# EAGLE board 8x8_stm32 (EAGLE 7.3.0)
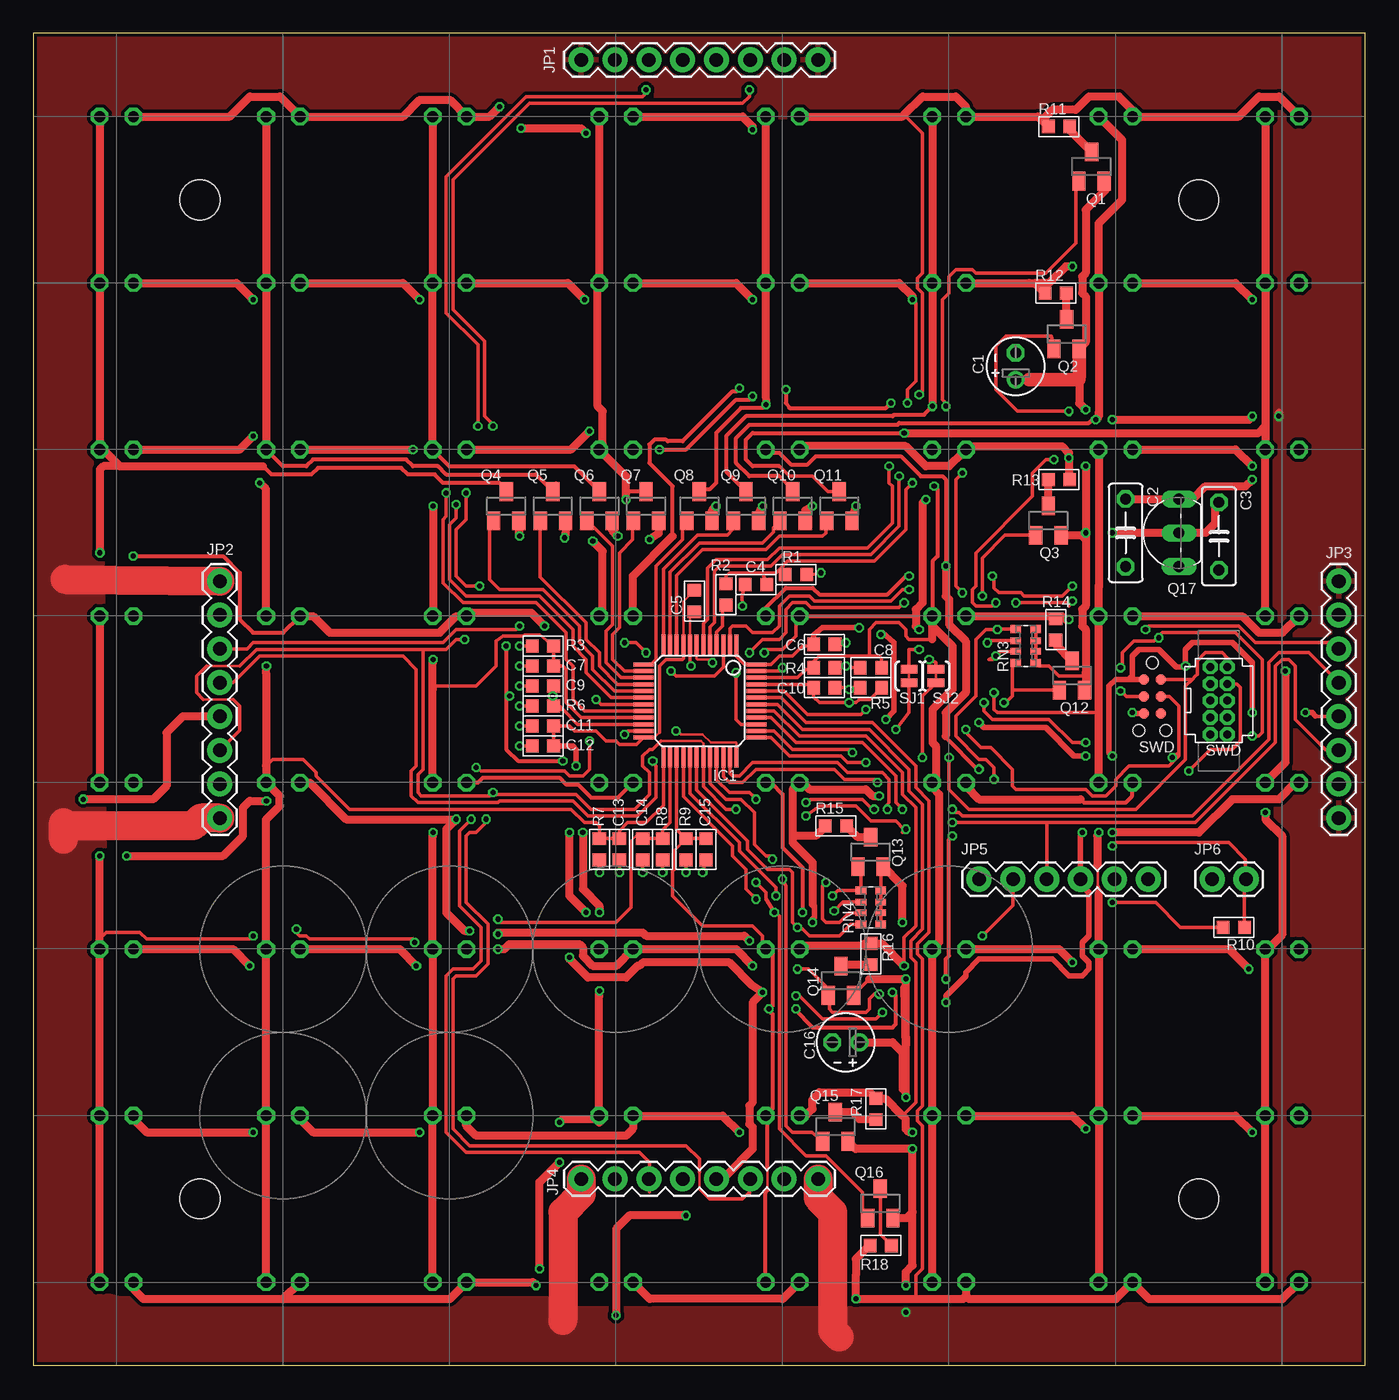
[diagram p1: board, top side]
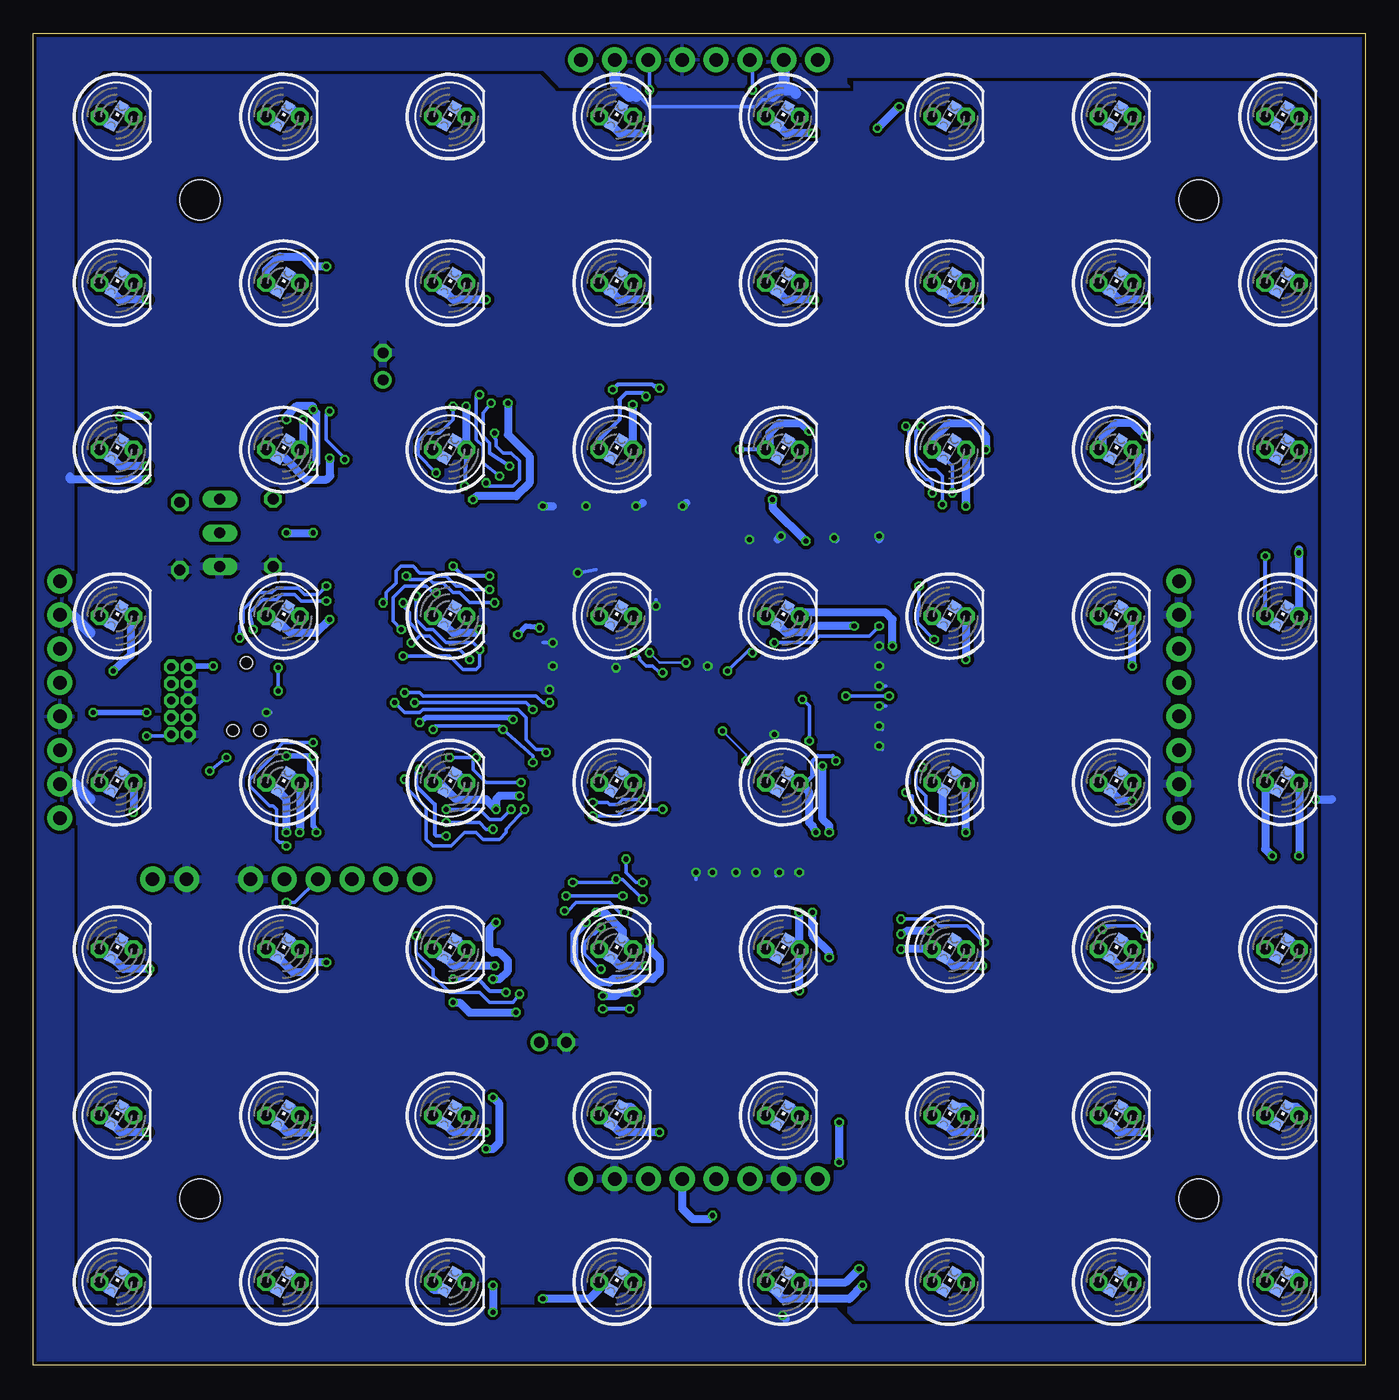
[diagram p2: board, bottom side, seen from below]

Size 100 x 100 mm. Coordinates in mm from the lower left corner, seen from the top.
Outline: 0,0 100,0 100,100 0,100 0,0
Copper layers (1*16): Top 0.035mm / dielectric 1.5mm / Bottom 0.035mm
Design rules "dirt_cheap_dirty_boards.v1": minimum track width 5mil, minimum drill 12mil, track to track 5mil, track to pad 5mil, pad to pad 5mil, via to via 5mil, smd to smd 0mil, copper to edge 10mil, drill to drill 10mil, minimum pad ring 10mil, minimum via ring 6mil, stop-mask expansion 2mil, vias tented up to drill 25mil, thermal gap 10mil
Holes 3 mm at 12.5,87.5 87.5,87.5 12.5,12.5 87.5,12.5

## Footprints (pad centres in the part's own frame; a part is rotated, then mirrored left to right if it is on the bottom)
E2-4 = drill 0.813 pad 1.27: + -1.016,0 | drill 0.813 pad 1.27 octagon: - 1.016,0
C050-025X075 = drill 0.813 octagon: 1 -2.54,0; 2 2.54,0
C0603-N = smd 0.95 x 1: 1 -0.8,0; 2 0.8,0
TQFP48 = smd 0.3 x 1.5: 1 -2.75,-4.25; 2 -2.25,-4.25; 3 -1.75,-4.25; 4 -1.25,-4.25; 5 -0.75,-4.25; 6 -0.25,-4.25; 7 0.25,-4.25; 8 0.75,-4.25; 9 1.25,-4.25; 10 1.75,-4.25; 11 2.25,-4.25; 12 2.75,-4.25; 25 2.75,4.25; 26 2.25,4.25; 27 1.75,4.25; 28 1.25,4.25; 29 0.75,4.25; 30 0.25,4.25; 31 -0.25,4.25; 32 -0.75,4.25; 33 -1.25,4.25; 34 -1.75,4.25; 35 -2.25,4.25; 36 -2.75,4.25 | smd 1.5 x 0.3: 13 4.25,-2.75; 14 4.25,-2.25; 15 4.25,-1.75; 16 4.25,-1.25; 17 4.25,-0.75; 18 4.25,-0.25; 19 4.25,0.25; 20 4.25,0.75; 21 4.25,1.25; 22 4.25,1.75; 23 4.25,2.25; 24 4.25,2.75; 37 -4.25,2.75; 38 -4.25,2.25; 39 -4.25,1.75; 40 -4.25,1.25; 41 -4.25,0.75; 42 -4.25,0.25; 43 -4.25,-0.25; 44 -4.25,-0.75; 45 -4.25,-1.25; 46 -4.25,-1.75; 47 -4.25,-2.25; 48 -4.25,-2.75
SWD_PTH_SHROUD = drill 0.6 octagon: 1 -2.54,-0.635; 2 -2.54,0.635; 3 -1.27,-0.635; 4 -1.27,0.635; 5 0,-0.635; 6 0,0.635; 7 1.27,-0.635; 8 1.27,0.635; 9 2.54,-0.635; 10 2.54,0.635
1X08_ROUND = drill 1.016 pad 1.88: 1 0,0; 2 2.54,0; 3 5.08,0; 4 7.62,0; 5 10.16,0; 6 12.7,0; 7 15.24,0; 8 17.78,0
1X06 = drill 1.016 pad 1.88: 1 0,0; 2 2.54,0; 3 5.08,0; 4 7.62,0; 5 10.16,0; 6 12.7,0
1X02 = drill 1.016 pad 1.88: 1 0,0; 2 2.54,0
TC2030-MCP-NL = smd 0.787 x 0.787: 1 1.27,-0.635; 2 1.27,0.635; 3 2.54,-0.635; 4 2.54,0.635; 5 3.81,-0.635; 6 3.81,0.635 | hole 0.889: 0,0; 5.08,-1.016; 5.08,1.016
LED5MM/SMD = drill 0.813 octagon: A -1.27,0; K 1.27,0 | smd 0.8 x 0.8 rotated 330: A1 -0.373,-0.609; K1 0.377,0.69
SOT23 = smd 1 x 1.4: 1 -0.95,-1.1; 2 0.95,-1.1; 3 0,1.1
TO92-INLINE = drill 0.813 long: GND -2.54,0; VIN 0,0; VOUT 2.54,0
R0603-N = smd 0.95 x 1: 1 -0.8,0; 2 0.8,0
EXB38V = smd 0.6 x 0.8: 1 -1.275,-0.75; 4 1.275,-0.75; 5 1.275,0.75; 8 -1.275,0.75 | smd 0.5 x 0.8: 2 -0.4,-0.75; 3 0.4,-0.75; 6 0.4,0.75; 7 -0.4,0.75
PAD-JUMPER-2-NC_BY_TRACE_YES_SILK = smd 0.635 x 1.27: 1 -0.508,0; 2 0.508,0

## Placement (x,y rotation side)
C1  [E2-4]  73.75,75 90 top
C2  [C050-025X075]  82,62.5 270 top
C3  [C050-025X075]  89,62.25 270 top
C4  100p  [C0603-N]  54.25,58.62 180 top
C5  [C0603-N]  49.62,57.38 270 top
C6  [C0603-N]  59.38,54.12 0 top
C7  100p  [C0603-N]  38.25,52.5 180 top
C8  100p  [C0603-N]  62.88,52.38 180 top
C9  100p  [C0603-N]  38.25,51 180 top
C10  100p  [C0603-N]  59.38,50.88 0 top
C11  [C0603-N]  38.25,48 180 top
C12  [C0603-N]  38.25,46.5 180 top
C13  100p  [C0603-N]  44,38.75 270 top
C14  100p  [C0603-N]  45.75,38.75 270 top
C15  100p  [C0603-N]  50.5,38.75 270 top
C16  [E2-4]  61,24.25 180 top
IC1  STM32F0  [TQFP48]  50.05,49.88 180 top
J1  SWD_SHROUD  [SWD_PTH_SHROUD]  89,49.9 270 top
JP1  [1X08_ROUND]  41.12,98 0 top
JP2  [1X08_ROUND]  14,58.88 270 top
JP3  [1X08_ROUND]  98,58.88 270 top
JP4  [1X08_ROUND]  41.12,14 0 top
JP5  [1X06]  71,36.5 0 top
JP6  [1X02]  88.5,36.5 0 top
JP7  TC2030-SWDNL  [TC2030-MCP-NL]  84,52.75 270 top
LED1  [LED5MM/SMD]  93.75,6.25 0 bottom
LED2  [LED5MM/SMD]  81.25,6.25 0 bottom
LED3  [LED5MM/SMD]  68.75,6.25 0 bottom
LED4  [LED5MM/SMD]  56.25,6.25 0 bottom
LED5  [LED5MM/SMD]  43.75,6.25 0 bottom
LED6  [LED5MM/SMD]  31.25,6.25 0 bottom
LED7  [LED5MM/SMD]  18.75,6.25 0 bottom
LED8  [LED5MM/SMD]  6.25,6.25 0 bottom
LED9  [LED5MM/SMD]  93.75,18.75 0 bottom
LED10  [LED5MM/SMD]  81.25,18.75 0 bottom
LED11  [LED5MM/SMD]  68.75,18.75 0 bottom
LED12  [LED5MM/SMD]  56.25,18.75 0 bottom
LED13  [LED5MM/SMD]  43.75,18.75 0 bottom
LED14  [LED5MM/SMD]  31.25,18.75 0 bottom
LED15  [LED5MM/SMD]  18.75,18.75 0 bottom
LED16  [LED5MM/SMD]  6.25,18.75 0 bottom
LED17  [LED5MM/SMD]  93.75,31.25 0 bottom
LED18  [LED5MM/SMD]  81.25,31.25 0 bottom
LED19  [LED5MM/SMD]  68.75,31.25 0 bottom
LED20  [LED5MM/SMD]  56.25,31.25 0 bottom
LED21  [LED5MM/SMD]  43.75,31.25 0 bottom
LED22  [LED5MM/SMD]  31.25,31.25 0 bottom
LED23  [LED5MM/SMD]  18.75,31.25 0 bottom
LED24  [LED5MM/SMD]  6.25,31.25 0 bottom
LED25  [LED5MM/SMD]  93.75,43.75 0 bottom
LED26  [LED5MM/SMD]  81.25,43.75 0 bottom
LED27  [LED5MM/SMD]  68.75,43.75 0 bottom
LED28  [LED5MM/SMD]  56.25,43.75 0 bottom
LED29  [LED5MM/SMD]  43.75,43.75 0 bottom
LED30  [LED5MM/SMD]  31.25,43.75 0 bottom
LED31  [LED5MM/SMD]  18.75,43.75 0 bottom
LED32  [LED5MM/SMD]  6.25,43.75 0 bottom
LED33  [LED5MM/SMD]  93.75,56.25 0 bottom
LED34  [LED5MM/SMD]  81.25,56.25 0 bottom
LED35  [LED5MM/SMD]  68.75,56.25 0 bottom
LED36  [LED5MM/SMD]  56.25,56.25 0 bottom
LED37  [LED5MM/SMD]  43.75,56.25 0 bottom
LED38  [LED5MM/SMD]  31.25,56.25 0 bottom
LED39  [LED5MM/SMD]  18.75,56.25 0 bottom
LED40  [LED5MM/SMD]  6.25,56.25 0 bottom
LED41  [LED5MM/SMD]  93.75,68.75 0 bottom
LED42  [LED5MM/SMD]  81.25,68.75 0 bottom
LED43  [LED5MM/SMD]  68.75,68.75 0 bottom
LED44  [LED5MM/SMD]  56.25,68.75 0 bottom
LED45  [LED5MM/SMD]  43.75,68.75 0 bottom
LED46  [LED5MM/SMD]  31.25,68.75 0 bottom
LED47  [LED5MM/SMD]  18.75,68.75 0 bottom
LED48  [LED5MM/SMD]  6.25,68.75 0 bottom
LED49  [LED5MM/SMD]  93.75,81.25 0 bottom
LED50  [LED5MM/SMD]  81.25,81.25 0 bottom
LED51  [LED5MM/SMD]  68.75,81.25 0 bottom
LED52  [LED5MM/SMD]  56.25,81.25 0 bottom
LED53  [LED5MM/SMD]  43.75,81.25 0 bottom
LED54  [LED5MM/SMD]  31.25,81.25 0 bottom
LED55  [LED5MM/SMD]  18.75,81.25 0 bottom
LED56  [LED5MM/SMD]  6.25,81.25 0 bottom
LED57  [LED5MM/SMD]  93.75,93.75 0 bottom
LED58  [LED5MM/SMD]  81.25,93.75 0 bottom
LED59  [LED5MM/SMD]  68.75,93.75 0 bottom
LED60  [LED5MM/SMD]  56.25,93.75 0 bottom
LED61  [LED5MM/SMD]  43.75,93.75 0 bottom
LED62  [LED5MM/SMD]  31.25,93.75 0 bottom
LED63  [LED5MM/SMD]  18.75,93.75 0 bottom
LED64  [LED5MM/SMD]  6.25,93.75 0 bottom
Q1  BSS84  [SOT23]  79.44,90 0 top
Q2  BSS84  [SOT23]  77.57,77.42 0 top
Q3  BSS84  [SOT23]  76.2,63.42 0 top
Q4  BSS123  [SOT23]  35.5,64.5 0 top
Q5  BSS123  [SOT23]  39,64.5 0 top
Q6  BSS123  [SOT23]  42.5,64.5 0 top
Q7  BSS123  [SOT23]  46,64.5 0 top
Q8  BSS123  [SOT23]  50,64.5 0 top
Q9  BSS123  [SOT23]  53.5,64.5 0 top
Q10  BSS123  [SOT23]  57,64.5 0 top
Q11  BSS123  [SOT23]  60.5,64.5 0 top
Q12  BSS84  [SOT23]  77.98,51.79 0 top
Q13  BSS84  [SOT23]  62.85,38.54 0 top
Q14  BSS84  [SOT23]  60.62,28.88 0 top
Q15  BSS84  [SOT23]  60.21,17.92 0 top
Q16  BSS84  [SOT23]  63.58,12.17 0 top
Q17  MCP1700  [TO92-INLINE]  86,62.5 90 top
R1  DNP  [R0603-N]  57.25,59.38 180 top
R2  2k2  [R0603-N]  52,57.88 270 top
R3  DNP  [R0603-N]  38.25,54 0 top
R4  DNP  [R0603-N]  59.38,52.38 180 top
R5  DNP  [R0603-N]  62.88,50.88 0 top
R6  DNP  [R0603-N]  38.25,49.5 0 top
R7  DNP  [R0603-N]  42.5,38.75 90 top
R8  DNP  [R0603-N]  47.25,38.75 90 top
R9  DNP  [R0603-N]  49,38.75 90 top
R10  [R0603-N]  90.12,32.88 180 top
R11  [R0603-N]  77,93 0 top
R12  [R0603-N]  76.75,80.5 0 top
R13  [R0603-N]  77,66.5 180 top
R14  [R0603-N]  76.75,55.25 270 top
R15  [R0603-N]  60.25,40.5 0 top
R16  [R0603-N]  62.88,30.88 270 top
R17  [R0603-N]  63.25,19.25 270 top
R18  [R0603-N]  63.62,9 0 top
RN3  [EXB38V]  74.5,54 90 top
RN4  [EXB38V]  62.88,34.38 90 top
SJ1  [PAD-JUMPER-2-NC_BY_TRACE_YES_SILK]  65.75,51.75 90 top
SJ2  [PAD-JUMPER-2-NC_BY_TRACE_YES_SILK]  67.75,51.75 90 top

## Tracks (layer width: path | path; a pad name or v marks a point on that pad's centre or on a via)
+3V3  (via drill 0.38)
  Top 0.2: IC1.9 48.8,57.35 C5.1 | 46.63,47.13 47,47.5
  Top 0.254: JP3.5 96.28,48.72 96.25,48.75 | C12.1 C11.1 40.25,48 40.62,47.62 42.25,47.62 43,46.88 43.75,46.88 44,46.62 45.3,46.62 IC1.24 46.63,47.13 | v63.75,26.5 63.25,26 59.25,26 57.5,27.75 v57.25,27.75 | R10.2 86.12,32.88 84.25,34.75 v81,34.75 | IC1.1 52.8,53.2 53.37,52.63 IC1.48 55.38,52.63 56,53.25 57,53.25 57.75,54 58.45,54 C6.1 | 47,47.5 47,52.5 47.5,53 48.75,53 48.8,53.05 IC1.9
  Top 0.406: v79,45.75 78.12,45.75 76,47.88 71.38,47.88 v71,48.25 | v63.62,54.88 63.75,55 64.62,54.25 64.62,49.12 v64,48.5 | v40.75,45 40.75,46.25 40.5,46.5 C12.1 | C6.1 58.58,54.83 59.25,55.38 v62,55.38 | v68.5,27.25 68.5,27.75 70,29.25 70,29.5 71,30.5 76.5,30.5 77.75,29.25 78.75,29.25 79.25,29.75 79.25,30.25 78.75,30.75 78.75,31.75 79.25,32.25 79.25,35.5 78.62,36.13 JP5.4 78.62,39.87 v78.75,40 | v95.5,49 96,49 96.25,48.75 | v81,45.75 80.75,46 80.75,51 81.25,51.5 82.25,51.5 | 82.25,51.5 83.34,51.5 JP7.1 | 82.25,51.5 82.5,51.75 82.5,53.25 83,53.75 84.5,53.75 85.81,52.44 86.44,52.44 v86.5,52.5 86.5,53.75 87,54.25 90,54.25 91.5,52.75 v91.5,49
  Top 0.61: C2.1 Q17.VOUT 87.04,65.04 88,66 91,66 v91.5,66.5 | v41.5,34 40.25,35.25 v40.25,40 | v40.25,30.62 40.25,30.5 41.62,29.12 44.5,29.12 45.38,30 45.5,30 45.75,30.25 52.25,30.25 54,28.5 v54.75,28 54,27.25 54,19.75 53.75,19.5 53.75,18.12 54,17.88 54,16.25 52,14.25 51.5,14.25 51.25,14 | JP2.5 11.21,48.72 10,47.5 10,43.5 9,42.5 v3.75,42.5 | v49,11.25 44.75,11.25 43.75,10.25 v43.75,3.75
  Bottom 0.254: v81,34.75 80.37,34.75 JP5.4
  Bottom 0.406: v81,45.75 79.25,45.75 | v71,48.25 70.5,48.62 64,48.62 v64,48.5 | v78.75,40 78.75,40.25 79,40.5 79,43 78.75,43.25 78.75,44.25 79.25,44.75 79.25,45.75 | 79.25,45.75 v79,45.75 | v62,55.38 63,55.5 v63.62,54.88 | v91.5,49 v95.5,49 | v86.5,52.5 88.31,52.5 J1.1
  Bottom 0.61: v68.5,27.25 68,27.25 67.25,26.5 v63.75,26.5 | v57.25,27.75 56.25,27.75 56,28 v54.75,28 | v41.5,34 41.5,32.25 40.25,31 v40.25,30.62 | v40.25,40 40.25,40.5 40.75,41 v40.75,45 | v3.75,42.5 2.5,42.5 | JP4.5 51.28,11.79 50.5,11 49.25,11 v49,11.25 | v43.75,3.75 43.5,3.5 | 97.25,66.75 97.25,66.5 v91.5,66.5
  pour Bottom (isolate 0.254): 39.25,100 0,100.25 0,-0.25 100,-0.25 100,4.25 39.75,4.25 38.5,3 5.5,3 3.25,5.25 3.25,95 5,96.75 39.25,96.75
  pour Bottom (isolate 0.254): 68.75,0 100.25,0 100.25,100.5 39.25,100.5 39,100.75 39,96.25 38.75,96 60.5,96 61.75,97.25 94.75,97.25 97,95 97,4.5 95,2.5 69,2.25 68.5,2.25
+5V  (via drill 0.38)
  Top 0.254: RN4.1 RN4.2 RN4.3 RN4.4 63.62,37.27 Q13.2 | 75.22,55.27 RN3.4 RN3.3 RN3.2 RN3.1 75.47,52.5 76.25,52.5 77,51.75 78.75,51.75 79,52 | Q14.2 61.9,28.15 62.75,29 | 2.38,59 2.38,58.62 2.25,58.5 2.25,59.5
  Top 0.61: v79,67.5 v79,62.5 79,62 | 79,62 79,57 78.75,56.75 78.75,55.5 79,55.25 79,52 79,50.76 Q12.2 | v65.5,20.12 65.5,21 | 65.5,21 65.5,23.8 65.4,28.4 65.5,24 v65.5,29 62.75,29 | v65.25,33.25 65.25,36 65.06,36.19 Q13.2 | 78.5,73.98 78.52,74 78.52,72.23 v79,71.75 | C16.+ 64.5,24.25 65.25,23.5 65.25,20.75 65.5,21 | 65.53,6.03 v65.5,6 65.5,7 66,7.5 66,11.5 | C3.1 88.75,64.54 88.75,63.25 88,62.5 Q17.VIN v81,62.5 | Q16.2 65.57,11.07 66,11.5 | 66,11.5 v66,16.25 61.73,16.25 Q15.2 | Q1.2 80.5,88.79 80.5,88.25 79,86.75 79,82 78.75,81.75 78.75,80.5 79,80.25 79,76.8 Q2.2 | Q3.2 78.68,62.32 79,62 | v81,71 91.25,71 v91.5,71.25 | v93.5,71.25 93.5,71.5 | C1.+ 74.73,73.98 74.75,74
  Top 1.016: 74.75,74 78.25,74 | 78.25,74 78.49,74 78.5,73.98 | Q2.2 78.52,74.27 78.25,74
  Top 2.184: 2.25,39.5 2.25,40.5 | 2.25,40.5 2.25,40.75 | JP4.1 41.12,12.88 39.75,11.5 39.75,3.38 | JP4.8 58.91,12.6 60,11.5 60,2.62 60.5,2.12 | JP2.8 12.6,41.09 12,40.5 2.25,40.5 | 2.38,59 JP2.1
  Bottom 0.61: v79,67.5 78.75,67.75 78.75,71.5 v79,71.75 79,72 80.25,72 81,71.25 v81,71 | v66,16.25 65.5,16.25 65,16.75 65,19.62 v65.5,20.12 | v65.5,29 65,29 64.38,29.62 64.38,30.38 65,31 65.5,31 65.75,31.25 65.75,32.75 v65.25,33.25 | v65.5,6 v65.5,4 | v81,62.5 v79,62.5 | v91.5,71.25 v93.5,71.25
  pour Top (isolate 0.254): 68.75,0 100.25,0 100.25,100.5 39.25,100.5 39,100.75 39,96.25 38.75,93.75 60.5,93.75 93.75,94.25 92.5,93.25 92.5,4.75 90,4.75 69.25,4.25 68.5,2.25
  pour Top (isolate 0.254): 60,100 0,100.25 0,-0.25 100,-0.25 100,4.25 39.75,4.25 39.5,5 6.5,5 5.5,5.25 5,93.5 5.5,94 60,93.75
CFET1
  Top 0.254: IC1.10 48.3,59.3 50.25,61.25 55,61.25 56,62.25 59.25,62.25 59.5,62.5 59.5,63.35 Q11.1
CFET2
  Top 0.254: IC1.11 47.8,59.55 50,61.75 54.75,61.75 55.55,62.55 55.55,62.9 Q10.1
CFET3
  Top 0.254: IC1.12 47.3,59.8 49.85,62.35 52.1,62.35 52.5,62.75 52.5,63.35 Q9.1
CFET4
  Top 0.254: Q8.1 48.75,63.1 48.75,62 46.75,60 46.75,53 46.38,52.63 IC1.13
CFET5
  Top 0.254: IC1.14 44.37,52.13 43.5,53 43.5,54.88 44,55.38 44,61 45,62 45,63.35 Q7.1
CFET6
  Top 0.254: IC1.15 44.12,51.63 43,52.75 43,55.12 43.5,55.62 43.5,61.5 41.6,63.4 Q6.1
CFET7
  Top 0.254: Q5.1 38.05,59.2 41.5,55.75 41.5,54.5 42.5,53.5 42.5,52.5 43.87,51.13 IC1.16
CFET8
  Top 0.254: IC1.17 43.62,50.63 42,52.25 42,53.25 41,54.25 41,55.5 38.25,58.25 35,58.25 34.25,59 34.25,63.1 Q4.1
COL1  (via drill 0.38)
  Top 0.2: 44.88,37.12 44.88,39.38 45.25,39.75 45.7,39.75 C14.1
  Top 0.254: IC1.26 47.8,40.75 47.25,40.2 R8.2 C14.1 | v34.88,33.5 35.12,33.25 43.75,33.25 44.88,34.38 44.88,37.12 | v28.62,31.75 28.5,32 20.75,32 20.5,32.25 20,32.25 19.75,32.5 v19.75,32.75 | v16.5,32.25 16.25,32 8.5,32 8,32.5 5.48,32.5 4.98,32 | 35.65,65.75 Q4.3
  Top 0.305: 17.25,67.5 17.88,66.88 20.88,66.88 21.38,67.38 27.62,67.38 28.12,66.88 30.12,66.88 30.75,66.25 35,66.25 35.5,65.75 35.65,65.75
  Top 0.61: LED8.K LED16.K LED24.K 4.98,32 4.98,38.23 | v4.98,38.25 4.98,38.23 | 4.98,38.23 5,38.25 | LED64.K LED56.K LED48.K 5.25,68.75 6.5,67.5 | 6.5,67.5 17.25,67.5 | 6.5,67.5 5.25,67.5 5,67.25 v5,61 | 5,56.27 LED40.K LED32.K
  Bottom 0.254: v34.88,33.5 32.5,33.5 32,33 29.88,33 v28.62,31.75 | v19.75,32.75 19.5,33 17.25,33 v16.5,32.25
  Bottom 0.61: LED24.K1 5.67,31.94 LED24.K | LED16.K1 5.17,19.44 4.98,19.25 LED16.K | LED8.K1 5.17,6.94 4.98,6.75 LED8.K | LED64.K1 5.67,94.44 LED64.K | LED56.K1 5.67,81.94 LED56.K | LED48.K1 5.67,69.44 LED48.K | LED40.K1 5.67,56.94 5,56.27 | 5,56.27 LED40.K | LED32.K1 5.67,44.44 LED32.K v4.98,38.25 | 5,61.25 v5,61 5,56.27
COL2  (via drill 0.38)
  Top 0.254: 17.48,45 17.98,45.5 20.25,45.5 21.25,44.5 21.25,44.25 23.75,41.75 40.38,41.75 41.38,40.75 42.25,40.75 42.5,40.5 R7.2 C13.1 44,40.12 44.62,40.75 46,40.75 47.3,42.05 IC1.25 | Q5.3 39,66 39.25,66.25
  Top 0.305: LED47.K 18.73,67.5 20.5,67.5 21,68 28,68 28.5,67.5 30.38,67.5 31,66.88 37.73,66.88 Q5.3
  Top 0.61: LED7.K LED15.K LED23.K 17.48,40.98 18.5,42 18.5,42.73 LED31.K 17.48,45 17.48,51.98 v17.5,52.5 | LED63.K LED55.K LED47.K 17.48,68.52 | LED39.K 17.48,65.77 v17,66.25
  Bottom 0.61: LED7.K1 18.17,6.94 LED7.K | LED15.K1 18.17,19.44 LED15.K | LED23.K1 18.17,31.94 LED23.K | LED31.K1 18.17,44.44 LED31.K | LED63.K1 18.17,94.44 LED63.K | LED55.K1 18.17,81.94 LED55.K | LED47.K1 17.68,68.75 LED47.K 17,68.27 v17,66.25 | v17.5,52.5 17.5,56.23 LED39.K 18.17,56.94 LED39.K1
COL3  (via drill 0.38)
  Top 0.2: 39,54 38,54.88 36.88,54.88 36.75,54.75
  Top 0.254: IC1.21 41.12,48.63 40,49.75 40,52.25 39.75,52.5 C7.1 R3.2 39,54 | 36.75,54.75 35.25,54.75 34.75,54.38 34.75,52.5 33.25,51 30.23,51 29.98,50.75 | 42.1,66 Q6.3
  Top 0.305: LED46.K 31.23,67.5 40.6,67.5 Q6.3
  Top 0.61: LED6.K LED14.K LED22.K 29.98,39.73 v30,40 | LED62.K LED54.K LED46.K | LED30.K 29.98,50.75 29.98,52.73 v30,53 | v30,64.5 30,56.27 LED38.K
  Bottom 0.61: LED6.K1 30.67,6.94 LED6.K | LED14.K1 30.17,19.44 29.98,19.25 LED14.K | LED22.K1 30.67,31.94 LED22.K | LED62.K1 30.67,94.44 LED62.K | LED54.K1 30.67,81.94 LED54.K | 29.98,66 LED46.K 30.67,69.44 LED46.K1 | 29.98,66 29.98,64.52 v30,64.5 30,65.98 29.98,66 | v30,53 30,56.23 LED38.K 30.67,56.94 LED38.K1 | LED30.K1 30.67,44.44 LED30.K 30,43.73 v30,40
COL4  (via drill 0.38)
  Top 0.254: IC1.22 40.87,48.13 39.75,49.25 | 39.75,49.25 39.5,49.5 R6.2 39.05,50.2 v39,50.25 39.05,50.3 C9.1 | 39.75,49.25 39,49.25 | v35.75,50.25 35.5,50.25
  Top 0.305: v35.5,54 35.5,50.25 35.5,46.25 36.38,45.38 v39.75,45.38 | Q7.3 44.6,65.6 44.5,65.5
  Top 0.61: 42.5,18.23 LED13.K | LED61.K LED53.K 42.38,81.14 42.38,72 42.75,71.62 42.75,69.12 42.48,68.86 LED45.K 44.5,66.73 44.5,65.5 v44.5,65 | 42.48,56.02 LED37.K 42.48,56.27 42.75,56.5 42.75,61.12 v42,61.88 | LED13.K 42.48,27.73 v42.5,28.12 | 42.5,34.25 v42.5,34 42.5,34.5 41.25,35.75 v41.25,40 | v38,7.25 38,13.75 v39.5,15.25 | v39.5,18.25 39.75,18.5 42.23,18.5 LED13.K
  Bottom 0.254: v39,50.25 v35.75,50.25
  Bottom 0.305: 42.25,43.75 42,43.75 41.5,44.25 41.5,45.38 41.12,45.75 40,45.75 v39.75,45.38
  Bottom 0.61: LED5.K1 43.17,6.94 LED5.K 39,6.25 v38,7.25 | LED13.K1 43.17,19.44 LED13.K | LED21.K1 43.17,31.94 LED21.K | LED53.K1 43.17,81.94 LED53.K | LED61.K 42.68,93.75 LED61.K1 | LED29.K 42.68,43.75 LED29.K1 | v41.25,40 41.5,40.5 41.75,40.75 41.75,43.02 LED29.K | LED45.K1 43.17,69.44 LED45.K | LED37.K1 42.68,56.25 LED37.K 42.23,56.5 36,56.5 35.5,56 v35.5,54 | LED29.K 42.25,43.75 | v42.5,28.12 42.5,31.23 LED21.K | LED21.K 42.48,34.02 v42.5,34 | v39.5,15.25 v39.5,18.25 | v44.5,65 44.5,64.38 v42,61.88
COL5  (via drill 0.38)
  Top 0.2: 55.12,13.17 55.12,14.8
  Top 0.23: 48.12,37.25 48.12,38.67 R9.2
  Top 0.254: LED20.K 54.75,31.48 54.75,32.25 54,33 50.25,33 48,35.25 48,37.12 48.12,37.25 | C15.1 R9.2 48.3,40.25 IC1.27 | 49.95,66.06 Q8.3
  Top 0.3: 65.5,59.25 v65.75,59.25
  Top 0.305: v55,72.12 54.75,71.88 53.12,71.88 51.25,70 51.25,66.25 50.75,65.75 50.15,65.75 Q8.3 | 65.5,59.25 64.12,57.88 59,57.88 58.5,58.38 56.5,58.38 54.98,56.85 LED36.K | 68.5,47.25 68.5,47.12 70.88,44.75 71,45 v71,44.75 | LED28.K 55.38,43.75 56.25,42.88 56.25,38.88 57.75,37.38 v57.75,34 | LED20.K 55.12,31.25 55.5,30.88 55.5,27.02 v55.23,26.75 55,26.75 55.5,26.38 55.5,19.27 LED12.K 55.12,18.61 55.12,14.8 | v57.25,26.75 57.12,26.75 58.5,25.38 64.5,25.38 64.75,25.62 64.75,27.75 v64.5,28 | v68.5,29 68.5,30.5 68.75,30.75 68.75,39.5 v69,39.75 | 54.98,68.52 55.98,68.52 56.88,67.62 58.12,67.62 58.75,68.25 65.12,68.25 66.62,66.75 68.25,66.75 68.5,66.5 v68.5,60 | LED4.K 54.98,12.98 55.12,13.17
  Top 0.61: LED60.K LED52.K 54.98,73.02 v55,72.12 | LED44.K 54.98,68.52 | v68.5,60 68.5,57.75 68.75,57.5 68.75,55.62 70,54.38 70,50.5 68.5,49 68.5,47.25
  Bottom 0.254: LED36.K1 55.67,56.94 | v69,39.75 69.75,39.75 69.88,39.88
  Bottom 0.3: v65.75,59.25 67.75,59.25 v68.5,60
  Bottom 0.305: 55.67,56.94 LED36.K | v71,44.75 71.25,44.5 71.25,43.5 69.88,42.12 69.88,39.88 | v55.23,26.75 v57.25,26.75 | v68.5,29 66.62,29 65.75,28.12 64.62,28.12 v64.5,28
  Bottom 0.61: LED4.K1 55.67,6.94 LED4.K | LED12.K1 55.17,19.44 54.98,19.25 LED12.K | LED20.K 55.67,31.94 LED20.K1 55.75,32.06 55.75,32.62 57.12,34 v57.75,34 | LED52.K 55.18,81.25 LED52.K1 | LED60.K 55.18,93.75 LED60.K1 | v55,72.12 55,68.77 LED44.K 55.67,69.44 LED44.K1 | LED28.K1 55.67,44.44 LED28.K
COL6  (via drill 0.38)
  Top 0.254: C8.1 63.67,53.08 63.5,53.25 62.75,53.25 | 62.75,53.25 59,53.25 58.58,52.83 R4.2 58.45,52.25 58,52.25 57.38,51.63 IC1.46 | 67.48,54.5 65.75,54.5 65.5,54.75 65.5,55.25 65,55.75 63.25,55.75 62.75,55.25 62.75,53.25
  Top 0.305: v67.5,72 66.88,71.38 64.62,71.38 64.5,71.25 53.5,71.25 52,69.75 52,67.1 Q9.3 | v67.62,66 67.88,65.75 67.88,60.75 67.5,60.38 67.5,56.27 LED35.K
  Top 0.61: LED3.K LED11.K LED19.K 68,31.77 68,42.88 67.48,43.4 LED27.K 67.75,44.02 67.75,46.5 67.5,46.75 67.5,49.25 69,50.75 69,54 67.48,55.52 | LED59.K LED51.K 67.48,72.02 v67.5,72 | LED35.K 67.48,55.52 | 67.48,54.5 67.48,55.52
  Bottom 0.254: LED35.K1 68.17,56.94 LED35.K
  Bottom 0.305: 67.5,68.73 v67.62,66
  Bottom 0.61: LED3.K1 68.17,6.94 LED3.K | LED11.K1 68.17,19.44 LED11.K | LED19.K1 68.17,31.94 LED19.K | LED51.K 67.68,81.25 LED51.K1 | LED59.K 67.68,93.75 LED59.K1 | v67.5,72 67.5,68.77 LED43.K | LED43.K1 68.17,69.44 LED43.K | LED27.K1 68.17,44.44 LED27.K | 67.5,68.73 LED43.K
COL7  (via drill 0.38)
  Top 0.2: 79.9,36.01 79.9,37.51
  Top 0.254: IC1.45 58.82,51.13 58.82,51.12 C10.1 58.58,50.17 59,49.75 v61.25,49.75 61.75,49.75 62,50 62.8,50 R5.2 | 79.98,49.25 79.73,49 72.38,49 72.12,49.25 v72.12,50.5 | 80,35.5 80,35.75 79.9,36.01 | 56,66.75 56.5,66.25 56.85,65.75 Q10.3
  Top 0.305: 79.98,71.5 79.23,70.75 65,70.75 64.88,70.62 53.75,70.62 52.75,69.62 52.75,67.75 53.75,66.75 56,66.75
  Top 0.61: LED58.K 81.75,91.98 81.75,87.5 79.98,85.73 LED50.K 79.98,71.5 79.98,71.23 v79.75,71 | LED42.K 79.98,58.52 | 79.98,58.52 80,58.5 | LED2.K LED10.K LED18.K 80,31.27 80,35.5 | LED26.K 79.98,49.25 LED34.K 79.98,58.52 | v80,40 79.88,39.75 79.88,37.53 79.9,37.51
  Bottom 0.254: LED34.K1 80.67,56.94 LED34.K | v61.25,49.75 61.75,49.75 62.25,50.25 70.75,50.25 71,50.5 v72.12,50.5
  Bottom 0.61: LED50.K1 80.67,81.94 LED50.K | v79.75,71 79.75,68.98 LED42.K 80.67,69.44 LED42.K1 | LED58.K1 80.67,94.44 LED58.K | LED26.K1 80.67,44.44 LED26.K 79.98,40.52 v80,40 | LED18.K1 80.67,31.94 LED18.K | LED2.K1 80.67,6.94 LED2.K | LED10.K1 80.67,19.44 LED10.K
COL8  (via drill 0.38)
  Top 0.254: C4.1 54.8,59.3 54.75,59.5 | 54.75,59.5 55.75,59.5 56,59.75 | 56,59.75 56.62,60.38 63.12,60.38 65.5,62.75 65.5,65.75 v66,66.25 | R2.1 52,59.25 52.25,59.5 54.75,59.5 | R1.2 56.38,59.38 56,59.75 | Q11.3 59.65,65.6 58.5,66.75 56.75,66.75 56,67.5
  Top 0.305: 56,67.5 54,67.5 53.5,68 53.5,69.5 54,70 v65.38,70
  Top 0.61: LED57.K LED49.K 92.48,70.5 | 92.48,70.5 LED41.K 92.5,68.73 92.5,56.27 LED33.K | v65.38,70 91.98,70 92.48,70.5 | LED1.K LED9.K LED17.K 92.76,31.53 92.97,31.53 93.75,32.32 93.75,39.75 92.5,41 v92.5,41.5 | v94,52.12 94,45.27 LED25.K
  Bottom 0.254: v66,66.25 66,66 64,66 63.5,66.5 63.5,67.88 64.12,68.5 64.75,68.5 65.25,69 65.25,69.5 65.5,69.75 v65.38,70
  Bottom 0.61: LED57.K1 93.17,94.44 LED57.K | LED49.K1 93.17,81.94 LED49.K | LED41.K1 93.17,69.44 LED41.K | LED17.K 92.68,31.25 LED17.K1 | LED9.K1 93.17,19.44 LED9.K | LED1.K1 93.17,6.94 LED1.K | LED33.K 92.68,56.25 | 92.68,56.25 LED33.K1 | 92.68,56.25 92.68,53.32 v94,52.12 | LED25.K1 93.17,44.44 LED25.K 92.48,41.52 v92.5,41.5
COMMS_DOWN  (via drill 0.38)
  Top 0.254: IC1.19 42.62,49.63 v42.25,50 | v33.25,44.88 33.62,44.62 39.88,44.62 40.25,44.25 41.25,44.25 41.75,44.75 v41.75,46.88 | JP4.3 46.25,13.04 46.25,15.25 45.5,16 32.5,16 31,17.5 31,29.25 31.5,29.75 33,29.75 33.62,30.38 33.62,32.88 32,34.5 32,40.12 v32.88,41
  Bottom 0.254: v42.25,50 41.75,49.5 v41.75,46.88 | v33.25,44.88 33.38,44.88 33.75,44.5 33.75,43.5 33,42.75 33,41.12 v32.88,41
COMMS_LEFT  (via drill 0.38)
  Top 0.254: v36.5,55.5 36.25,55.25 31.75,55.25 30.75,54.25 16.5,54.25 16.05,53.8 JP2.3 | v44.38,54.25 45.25,54.25 v46,53.5 | IC1.3 51.8,52.42 51.12,51.75 48.25,51.75 v47.88,52.12
  Bottom 0.254: v36.5,55.5 37.25,54.75 41,54.75 41.5,54.25 v44.38,54.25 44.5,54.25 | v46,53.5 46.25,53.75 v47.88,52.12
COMMS_RIGHT  (via drill 0.38)
  Top 0.254: JP3.3 97.75,53.75 97.25,54.25 91.75,54.25 90.5,55.5 83.75,55.5 v83.5,55.25 | 77.75,57 v78,57.38 77.88,57.25 v73.75,57.25 | v65.75,58.25 65.25,58.25 64.38,57.38 58.62,57.38 58.25,57.75 56.75,57.75 56,57 56,55.5 55.5,55 54,55 53.5,55.5 52.5,55.5 52.3,55.3 IC1.2
  Bottom 0.254: v73.75,57.25 73.5,57.5 73.5,58 72.75,58.75 72.75,59.62 72.38,60 71.5,60 71,59.5 70,59.5 69.75,59.25 69,59.25 68.25,58.5 67.75,58.5 67.5,58.25 v65.75,58.25 | v83.5,55.25 83.75,56.5 82.75,57.5 81.75,57.5 81.38,57.88 80.38,57.88 79.88,57.38 v78,57.38
COMMS_UP  (via drill 0.38)
  Top 0.254: IC1.18 43.37,50.13 41.5,52 41.5,53 40.5,54 40.5,55.25 38,57.75 32.5,57.75 31.25,59 31.25,63.12 31.75,63.62 v31.75,64.62 | v33.38,70.5 33.38,76.62 31,79 31,89.25 37,95.25 45.75,95.25 46,95.5 v46,95.75
  Bottom 0.254: v31.75,64.62 31.75,66.75 32.25,67.25 32.75,67.25 33.75,68.25 33.75,70.12 v33.38,70.5 | v46,95.75 46,97.8 JP1.3
G_UART  (via drill 0.38)
  Top 0.2: IC1.31 50.3,46.7 50.12,46.88 47.12,46.88 | 15.5,52.5 13,52.5 | 34.5,42.88 34.38,42.75 | 12.75,50 15,50 | 50,13.25 50,14.5
  Top 0.254: 76,40.75 87.25,40.75 93.25,46.75 93.25,52.5 93.75,53 94.25,53 94.75,52.5 94.75,48.5 97,46.25 97.67,46.25 JP3.6 | 76,40.75 v69,40.75 | 65.25,40 v65.5,40.25 65.38,40.25 64.75,40.88 62.88,40.88 61.75,42 59,42 v58,41.25 | IC1.31 50.3,43.45 52,41.75 v52.75,41.75 | v33.5,58.5 32.5,58.5 31.75,59.25 31.75,62.75 32.5,63.5 v32.5,65.5 | 29.25,53.75 31,53.75 31.75,54.5 v32.38,54.5 | 29.25,53.75 29.25,44.75 28.88,44.38 28.88,43 29.12,42.75 34.25,42.75 v34.5,43 | JP5.3 76.08,40.67 76,40.75 | 29.25,53.75 16.75,53.75 15.5,52.5 | 13,52.5 12.25,51.75 12.25,50.5 12.75,50 | 50,13.25 50.75,12.5 53.25,12.5 53.75,13 53.75,12.93 JP4.6 | 34.5,42.88 v34.5,43 | v34.5,70.5 34.5,70.62 33.88,71.25 33.88,76.88 31.5,79.25 31.5,89 37.25,94.75 53.25,94.75 53.75,95.25 v53.75,95.75 | 47.12,46.88 46.5,46.25 46.25,46.25 45.75,45.75 45.75,45 46.25,44.5 46.25,42.88 45.12,41.75 41.88,41.75 40.75,42.88 34.62,42.88 v34.5,43 | v34,41 34,40.75 33.25,40 32.75,40 32.5,39.75 32.5,34.75 34.12,33.12 34.12,30.12 33.25,29.25 31.75,29.25 31.5,29 31.5,17.75 32.75,16.5 49,16.5 50,15.5 50,14.5 | 15,50 15.5,49.5 15.5,47.67 JP2.6
  Bottom 0.254: v52.75,41.75 55.62,41.75 56.12,41.25 v58,41.25 | 32.38,54.62 v32.38,54.5 33.62,55.75 33.62,56.62 33.5,56.75 v33.5,58.5 | v34.5,70.5 34.5,70.38 34.25,70.12 34.25,67.75 33,66.5 32.75,66.5 32.5,66.25 v32.5,65.5 | v34,41 34,42.75 34.25,42.75 v34.5,43 | v65.5,40.25 66,40.25 66.5,40.75 v69,40.75 | v53.75,95.75 53.75,97.92 JP1.6
GND  (via drill 0.38)
  Top 0.2: IC1.8 49.3,56.25 C5.2
  Top 0.254: C12.2 v36.5,46.5 | C11.2 v36.5,48 | R6.1 v36.5,49.5 | C9.2 v36.5,51 | C7.2 v36.5,52.5 | R3.1 v36.5,54 | R7.1 v42.5,37 | C13.2 v44,37 | C6.2 60.88,54.12 v61,54.25 | R4.1 60.88,52.38 v61,52.5 61.12,52.38 C8.2 | C4.2 53.2,57.8 v53.25,57 | R1.1 59.3,59.45 v59.12,59.5 | C10.2 61.12,50.88 v61.25,50.75 61.38,50.88 R5.1 | C15.2 v50.25,37 | R9.1 v49,37 | R8.1 v47.25,37 | C14.2 v45.75,37 | IC1.8 49.3,52.95 v49.38,52.5 | IC1.23 44.63,47.63 v44.38,47.38 | IC1.47 56.01,52.13 v56.25,52.38
  Top 0.406: JP7.5 82.56,48.94 v82.5,49
  Top 0.61: Q4.2 36.45,62.55 v36.5,62.25 | Q5.2 39.95,62.45 v39.88,62.12 | Q6.2 43.45,62.67 v43.88,62.25 | Q7.2 46.95,62.45 v46.25,62 | Q8.2 50.95,64.2 v51.25,64.5 | Q11.2 61.45,63.2 v61.75,64.5 | Q10.2 57.95,64.2 v58.5,64.5 | Q9.2 54.45,63.95 v54.75,64.5
  Bottom 0.254: v49.38,52.5 49.5,52.25 | v36.5,46.5 36.25,46.25 | v36.5,48 36.25,47.75 | v36.5,49.5 36,49.5 | v36.5,51 36,51 | v36.5,52.5 36.25,52.5 | v36.5,54 36.25,54 | v42.5,37 42.5,36.75 | v44,37 44.25,36.75 | v61,54.25 61.75,54.25 | v61,52.5 61,52.25 | v53.25,57 53.25,57.5 | v59.12,59.5 57.75,59.75 | v61.25,50.75 61.25,51 | v50.25,37 50.25,36.5 | v47.25,37 47.25,36.75 | v45.75,37 45.75,36.75 | 54.75,95.25 54.5,95.25 53.75,94.5 45.75,94.5 45.25,95 44.75,95 44.12,95.62
  Bottom 0.406: v82.5,49 82.25,49
  Bottom 0.61: v36.5,62.25 36.5,62 | v39.88,62.12 39.75,62 | v43.88,62.25 44.12,62 | v51.25,64.5 51,64.75 | v54.75,64.5 54.25,64.75 | v61.75,64.5 61,64.5
  Bottom 0.813: JP1.7 56.37,96.36 55.5,95.5 | 55.5,95.5 55,95.5 54.75,95.25 | JP1.2 43.66,95.92 | 43.66,95.92 43.5,95.75 43,95.75 42.75,95.5 | 43.66,95.92 43.84,95.92 44.12,95.62 44.5,95.25 | 55.25,95.25 55.5,95.5 | JP3.7 96.89,43.63 95.75,42.5 | JP3.2 97,56.25 95.75,55
  pour Bottom (isolate 0.254, rank 2): 102.75,101 103.5,100.25 103.5,0.25 -1.25,-2.25 -6.75,100.5
N$9  (via drill 0.38)
  Top 0.254: IC1.44 56.37,50.63 58.12,48.88 62.12,48.88 v62.5,49.25 | v79,46.75 78,46.75 76.25,48.5 72,48.5 71.38,49.12 v71.38,49.75 | v81,39 81.25,39.25 89.75,39.25 91,38 91,36.54 JP6.2 90.92,36.38 R10.1
  Bottom 0.254: v62.5,49.25 63,49.75 v71.38,49.75 | v79,46.75 81.25,46.75 81.75,46.25 81.75,46 83.75,44 83.75,43.5 82.25,42 82,42 81.75,41.75 81.75,39.5 81.5,39.25 81.25,39.25 v81,39
N$11
  Top 0.254: IC1.4 51.3,55.05 51.75,55.5 51.75,56.83 R2.2
N$12
  Top 0.61: R11.2 77.8,92.74 Q1.3
N$13
  Top 0.61: Q2.3 77.57,80.48 R12.2
N$14
  Top 0.61: Q3.3 R13.2
N$15
  Top 0.61: R14.2 76.75,54.12 Q12.3
N$16
  Top 0.61: Q13.3 61.91,39.64 R15.2
N$17
  Top 0.61: R16.2 60.98,30.07 Q14.3
N$18
  Top 0.61: Q15.3 61.48,19.02 62,18.5 63.2,18.5 R17.2
N$19
  Top 0.254: Q16.3 63.58,9.85 R18.2
NRST  (via drill 0.38)
  Top 0.2: IC1.7 49.8,53.08 49.88,53 50.75,53 v51,52.75
  Top 0.254: v65.38,57.25 65,56.88 58.38,56.88 58,57.25 57,57.25 56.5,56.75 56.5,55 56,54.5 54.75,54.5 v53.75,53.5 | v78,58.5 77.25,57.75 74.38,57.75 74.12,58 72.5,58 72.12,58.38 72.12,59.12 v72,59.25 | JP7.3 82.04,50.21 v81.62,50.62 | v81.62,52.38 81.75,52.5 81.75,53.5 82.62,54.38 84.12,54.38 84.38,54.62 v84.5,54.62 84.5,54.75 84.75,55 90.25,55 92.25,53 92.25,47.5 92,47.25 v91.5,47.25
  Bottom 0.2: v51,52.75 53,52.75 v53.75,53.5
  Bottom 0.254: v84.5,54.62 84.5,55.5 84.25,55.75 84.25,56.75 83,58 82.12,58 81.75,58.38 80.12,58.38 79.62,57.88 78.62,57.88 v78,58.5 78.25,58.25 | v72,59.25 71.75,59 70.25,59 70,58.75 69.25,58.75 68.5,58 68,58 67.25,57.25 v65.38,57.25 | v81.62,50.62 v81.62,52.38 | v91.5,47.25 89.75,47.25 J1.10
RFET1  (via drill 0.38)
  Top 0.254: IC1.33 51.3,43.95 52.25,43 53.75,43 v54.25,42.5 | v58,42.25 58.38,42.5 62.25,42.5 63,41.75 v63.12,41.75 | v69.75,67 69.25,66.5 69.25,58.5 v69.75,58 | 72.12,44.12 v72.12,44 72.12,44.88 71.5,45.5 71,45.5 69.25,47.25 69.25,48.75 70.75,50.25 70.75,54.5 71.5,55.25 v72.38,55.25 72.47,55.27 RN3.5 | Q1.1 78.25,88.66 78.25,84.25 76,82 70.75,82 70.5,82.25 69.25,82.25 68.75,81.75 68.75,80.5 68.25,80 68.25,72.5 68.5,72.25 v68.5,72
  Bottom 0.254: v54.25,42.5 55.75,42.5 56.12,42.12 56.75,42.12 56.88,42.25 v58,42.25 | v68.5,72 68.5,71 69.5,70 70.5,70 71.12,69.38 71.12,68.38 v69.75,67 | v69.75,58 70,58 70.5,58.5 72.12,58.5 73,57.62 73,55.88 v72.38,55.25 | v72.12,44 72,44.12 71.88,44.12 71.88,43.25 70.5,41.88 70.5,39.5 70,39 68.62,39 67.62,40 66.75,40 66.25,39.5 65,39.5 64.5,40 64.5,40.25 v63.12,41.75
RFET2  (via drill 0.38)
  Top 0.254: SJ2.2 67.75,52.75 v67.25,53 | v72.25,57.25 72,57 70.75,57 70.5,57.25 70.5,58.25 70.75,58.5 70.75,61 75,65.25 75,67 76,68 v76.62,68 | v77.75,71.62 73.88,71.62 72.25,73.25 72.25,76.5 73,77.25 76.44,77.25 Q2.1 | RN3.6 71.9,54.4 v71.62,54.25
  Bottom 0.254: 70.88,54.88 70.75,54.75 70.25,54.75 69.25,53.75 68,53.75 v67.25,53 | 70.88,54.88 71.75,55.75 71.75,56.5 72.25,57 v72.25,57.25 | v76.62,68 76.62,68.12 78,69.5 78,71.38 v77.75,71.62 | v71.62,54.25 71.5,54.25 70.88,54.88
RFET3  (via drill 0.38)
  Top 0.254: SJ1.2 65.75,53.75 v66.5,53.75 | RN3.7 72.6,53.6 72,53 71.75,53 v72.25,53.25 | v71.25,57.75 71.25,60.62 72.94,62.32 Q3.1
  Bottom 0.254: v71.25,57.75 71.25,56 70.5,55.25 70,55.25 69,54.25 67,54.25 v66.5,53.75 66.5,52.5 66.75,52.25 67.75,52.25 68.75,53.25 v72.25,53.25
RFET4  (via drill 0.38)
  Top 0.254: IC1.38 55.62,47.63 57,46.25 61.25,46.25 v61.5,46 | v72.88,49.75 73,49.75 73.5,50.25 73.5,50.75 | 73.5,50.75 73.5,52.48 RN3.8 | Q12.1 73.56,50.69 73.5,50.75
  Bottom 0.254: v61.5,46 61.75,46.25 62.25,46.25 63,47 63,48.62 63.62,49.25 70.75,49.25 71,49 72.12,49 v72.88,49.75
RFET5  (via drill 0.38)
  Top 0.254: IC1.29 49.3,42.95 53,39.25 53,38.62 55.75,35.88 v55.75,35.25 | Q13.1 62.12,37.22 RN4.5 60.4,35.65 v60,35.25
  Bottom 0.254: v60,35.25 v55.75,35.25
RFET6  (via drill 0.38)
  Top 0.254: IC1.30 49.8,43.2 53.62,39.38 53.62,38.75 55.12,37.25 56.75,37.25 57,37 57,33.25 v57.38,32.88 57.25,32.75 57.75,32.75 58.25,32.25 60.5,32.25 61.35,33.1 RN4.8 | v57.38,29.75 58.2,29.75 59.67,28.27 Q14.1 | Q14.1 59.8,27.45 | JP5.2 73.54,34.54 v71.25,32.25 | v63.5,27.88 63.12,27.88 62.75,27.5 62.75,26.75 62.5,26.5 60,26.5 59.75,26.75 59.75,27.7 Q14.1
  Bottom 0.254: v57.38,29.75 57.5,29.75 58.62,30.88 58.62,31.75 58,32.38 57.88,32.38 v57.38,32.88 | v71.25,32.25 71.25,31 70,29.75 70,29.25 68.75,28 66.5,28 65.75,27.25 64,27.25 v63.5,27.88
RFET7  (via drill 0.38)
  Top 0.254: IC1.28 48.8,42.7 52.5,39 52.5,38.25 53.5,37.25 53.5,35.75 v54.25,35 | v56.25,36.5 56.5,36 56.5,18 57,17.5 58.44,17.5 Q15.1 | v59.5,36.25 59.25,36 59.25,33.5 59.5,33.25 60.5,33.25 61.23,33.98 RN4.7
  Bottom 0.254: v54.25,35 55.75,36.5 v56.25,36.5 56.25,36.25 v59.5,36.25
RFET8  (via drill 0.38)
  Top 0.254: v54.25,36.25 55,35.5 55,35 v55.62,34 56,33.75 56,17.75 58,15.75 59.5,15.75 62.25,13 62.25,11.45 Q16.1 | IC1.32 50.8,43.7 52,42.5 53.12,42.5 54.12,41.5 54.12,39.12 55,38.25 55.25,38.25 v55.5,38 | RN4.6 60.77,34.77 v60.12,34.12
  Bottom 0.254: v60.12,34.12 59.88,34.12 59.25,34.75 56.75,34.75 56,34 v55.62,34 | v54.25,36.25 54.75,36.25 55.5,37 v55.5,38
ROW1  (via drill 0.38)
  Top 0.254: 65,66.5 v65,66.75 65,63 62.88,60.88 56.25,60.88 55.38,60 51.5,60 51.12,59.62 51.12,55.75 50.8,55.42 IC1.5 | v66.5,72.88 66.75,73.12 66.75,80.5 66.38,80.88 66.38,81.62 66.75,82 66.75,92.5 65.38,93.88
  Top 0.61: LED64.A 14.75,93.75 16.25,95.25 18.52,95.25 LED63.A 27.75,93.75 29,95 31.27,95 LED62.A 34.25,93.75 v35,94.5 | LED57.A 93.52,95.25 92,95.25 90.5,93.75 LED58.A 82.52,94.23 81.5,95.25 79.25,95.25 78.25,94.25 76.5,94.25 75.72,93.47 | LED60.A 65.25,93.75 65.38,93.88 66.75,95.25 69.25,95.25 70,94.5 70,93.77 LED59.A 75.45,93.75 75.72,93.47 | LED61.A 53.25,93.75 54,93 v54,92.75 | v36.62,92.88 41.12,92.88 v41.5,92.5 | 75.72,93.47 R11.1
  Bottom 0.254: v65,66.75 66.25,67.75 66.25,69 66.75,69.5 66.75,72.75 v66.5,72.88
  Bottom 0.61: LED64.A 7.23,93.75 LED64.A1 | LED62.A1 31.91,93.14 LED62.A | LED63.A1 19.41,93.14 LED63.A | LED61.A 44.41,93.14 LED61.A1 43.48,92.5 v41.5,92.5 | LED57.A1 94.41,93.14 LED57.A | LED59.A1 69.41,93.14 LED59.A | LED58.A1 81.91,93.14 LED58.A | LED60.A 56.91,93.14 LED60.A1 56.62,93.12 56,92.5 54.25,92.5 v54,92.75 | v35,94.5 v36.62,92.88
ROW2  (via drill 0.38)
  Top 0.254: v65.62,72.25 65.62,73.25 66.25,73.88 66.25,79.75 v66,80 | v64.25,67.5 64.25,66.25 64.5,66 64.5,63.25 62.62,61.38 56,61.38 55.12,60.5 51.25,60.5 50.62,59.88 50.62,56 50.3,55.67 IC1.6
  Top 0.61: LED56.A 15.25,81.25 v16.5,80 | LED55.A 27.75,81.25 v29,80 | LED54.A 40.12,81.25 v41.38,80 | LED53.A 52.75,81.25 v54,80 | LED52.A 65,81.25 66,80.25 v66,80 | LED50.A 90.25,81.25 v91.5,80 | LED51.A 74.75,81.25 75.2,81.25 | 75.2,81.25 R12.1 | v78,82.5 77.5,82.5 76.25,81.25 75.2,81.25
  Bottom 0.254: v64.25,67.5 65.75,68.5 65.75,69.25 66.25,69.75 66.25,71.5 v65.62,72.25
  Bottom 0.61: v16.5,80 18.48,80 LED55.A1 19.41,80.64 LED55.A | v29,80 30.98,80 LED54.A1 31.91,80.64 LED54.A | v41.38,80 43.48,80 LED53.A1 44.41,80.64 LED53.A | v54,80 55.98,80 LED52.A1 56.91,80.64 LED52.A | v66,80 68.48,80 LED51.A1 69.41,80.64 LED51.A | LED56.A1 6.91,80.64 LED56.A | LED49.A 94.73,81.25 LED49.A1 93.48,80 v91.5,80 | LED50.A1 81.91,80.64 LED50.A 82.52,82.23 81.5,83.25 79.75,83.25 79,82.5 v78,82.5
ROW3  (via drill 0.38)
  Top 0.254: IC1.20 41.37,49.13 40.5,50 40.5,52.5 40,53 40,55 37.75,57.25 32.25,57.25 30.75,58.75 30.75,63.5 31,63.75 v31,65.5 | 32.75,68.75 LED46.A
  Top 0.305: v47,68.75 49,68.75 52.75,72.5 53.75,72.5 v54,72.75
  Top 0.61: LED48.A 15.5,68.75 v16.5,69.75 | LED47.A v28.5,68.75 | LED42.A 90.25,68.75 v91.5,67.5 | LED44.A 57.77,69 65.5,69 67,67.5 68.75,67.5 69.75,68.5 69.75,68.75 LED43.A 70.02,68.77 70.25,69 77.25,69 77.75,68.5 v77.75,68.12 77.75,66.55 R13.1 | LED46.A 40.38,68.75 v41.75,70.12
  Bottom 0.254: LED46.A 32.25,68.75 | v31,65.5 31,67.52 LED46.A1
  Bottom 0.305: LED45.A v47,68.75 | v54,72.75 54.25,73 55.5,73 56,72.5 56,71 57.5,69.5 57.5,68.77 LED44.A
  Bottom 0.61: LED47.A1 19.41,68.14 LED47.A 19.75,69.02 19.75,69.75 18.75,70.75 17.5,70.75 v16.5,69.75 | LED48.A1 6.91,68.14 LED48.A | LED46.A1 31.91,68.14 LED46.A 32.52,69.48 31.25,70.75 29.5,70.75 28.5,69.75 v28.5,68.75 | v91.5,67.5 93.48,67.5 LED41.A1 94.41,68.14 LED41.A | LED42.A 81.91,68.14 LED42.A1 81.14,68.14 79.5,66.5 77.97,66.5 77.7,66.77 77.7,67.95 v77.75,68.12 | LED43.A1 69.41,68.14 LED43.A | LED44.A1 56.91,68.14 LED44.A | LED45.A1 44.73,68.75 LED45.A 44.75,69.02 44.75,70 44,70.75 42.38,70.75 v41.75,70.12
ROW4  (via drill 0.38)
  Top 0.254: IC1.39 53.12,48.13 52.75,48.5 v52.75,52 | v54.88,53.5 54.88,53.62 55,53.75 56.25,53.75 57.25,54.75 57.25,55.75 57.13,55.87 LED36.A | 77.5,56 77.5,55.75 v77.75,56 | R14.1 76.75,56.25
  Top 0.305: 48,62.25 48,66 46.25,67.75 46.25,69.12 46.62,69.5 47.5,69.5 47.62,69.38 48.75,69.38 52.5,73.12 52.75,73.12 v53,73.38 | v56.5,73.25 56.5,72.25 56.75,71.88 64,71.88 v64.38,72.25 | LED36.A 66.25,56.25 | v7.5,60.75 14.25,60.75 15.5,59.5 15.5,56 16.5,55 18.77,55 LED39.A
  Top 0.61: LED35.A 76.75,56.25 77.25,56.25 77.5,56 | LED34.A 90.75,56.25 92,55 93.77,55 LED33.A | v38.38,55.5 37.38,56.5 32.75,56.5 32.52,56.27 LED38.A 31.75,56.25 30.5,55 22.25,55 21,56.25 LED39.A | LED37.A 45.02,59.27 48,62.25 | v67,65 66.75,64.75 66.75,57.25 66.25,56.75 66.25,56.25 66.25,55.5 v66.5,55.25
  Bottom 0.254: LED36.A1 56.91,55.64 LED36.A | v52.75,52 53,52 53.5,52.5 54,52.5 54.5,53 54.5,53.12 v54.88,53.5
  Bottom 0.305: v53,73.38 53.12,73.38 53.25,73.5 53.38,73.5 53.5,73.62 56.12,73.62 v56.5,73.25 | LED40.A 7.52,60.73 v7.5,60.75
  Bottom 0.61: LED39.A1 19.41,55.64 LED39.A | LED38.A1 31.91,55.64 LED38.A | LED40.A1 6.91,55.64 LED40.A | LED34.A 82.23,56.25 LED34.A1 81.39,55.64 80.75,55 78.75,55 v77.75,56 | LED33.A1 94.41,55.64 LED33.A | v38.38,55.5 41.25,55.5 41.75,55 43.48,55 LED37.A1 44.73,56.25 LED37.A | LED35.A 69.73,56.25 LED35.A1 69.12,55.62 68.5,55 66.75,55 v66.5,55.25 | v64.38,72.25 64.38,69.88 62.75,68.25 62.75,66.25 63.75,65.25 66.75,65.25 v67,65
ROW5  (via drill 0.38)
  Top 0.254: IC1.40 55.37,48.63 57.25,46.75 62.25,46.75 64.75,44.25 64.75,42.25 v65.25,41.75
  Top 0.305: LED30.A 33.38,43.75 33.75,44.12 39.5,44.12 40,43.62 40.88,43.62 41.88,42.62 43.9,42.62 LED29.A | 78.62,42.5 78.88,42.25 82,42.25 82.5,42.75 82.5,43.73 LED26.A
  Top 0.406: v58.5,33.25 58.5,33.5 58.62,33.62 58.62,34.5 58.5,34.62
  Top 0.61: LED31.A 20.75,43.75 23.5,41 v31.75,41 31,40.25 31,34 32.38,32.62 v32.75,32.62 | LED25.A 94.75,43.75 93.5,42.5 90,42.5 87.5,40 v81,40 | v63.5,42.75 63,42.75 62.5,43.25 58.25,43.25 57.75,43.75 LED28.A 57,43.23 57,39.75 | v53.75,31.88 53.38,32.25 46,32.25 45.75,32.5 34.88,32.5 v34.88,32.38 | 57,39.75 57,39.25 58.5,37.75 58.5,34.62 | v7,38.25 14.25,38.25 15.75,39.75 15.75,41.88 16.25,42.38 v17.5,42.38 | LED27.A 70.02,43.48 71,42.5 78.62,42.5 | R15.1 59.45,40.45 58.75,39.75 57,39.75
  Bottom 0.254: LED27.A1 69.41,43.14 LED27.A | 31.75,42.98 31.75,43.01 LED30.A1
  Bottom 0.61: LED30.A 32.23,43.75 LED30.A1 | v17.5,42.38 18.36,42.38 LED31.A1 19.73,43.75 LED31.A | LED27.A 69.5,43.75 68.25,42.5 66,42.5 v65.25,41.75 65.25,42.5 65,42.75 v63.5,42.75 | LED26.A 82.23,43.75 LED26.A1 81.62,43.12 81,42.5 v81,40 | LED29.A1 44.41,43.14 LED29.A | LED25.A1 94.41,43.14 LED25.A | LED32.A1 6.91,43.14 LED32.A 7.52,38.77 v7,38.25 | v32.75,32.62 34.38,32.62 v34.88,32.38 | v53.75,31.88 53.75,31.25 53,30.5 53,29.5 53.5,29 56.5,29 56.75,28.75 57.75,28.75 59.38,30.38 59.38,32.38 v58.5,33.25 | LED28.A 57.23,43.75 LED28.A1 | 31.75,42.98 v31.75,41
ROW6  (via drill 0.38)
  Top 0.254: IC1.41 55.62,49.13 57.5,47.25 62.5,47.25 65.25,44.5 65.25,42.88 66.25,41.88 66.25,33 65.38,32.12 v65.38,30
  Top 0.61: LED24.A 15,31.25 v16.25,30 | LED23.A 27.5,31.25 v28.75,30 | v54,30 52.75,31.25 LED21.A 43.77,30 42,30 41.25,30.75 41.25,31.38 41,31.62 35.75,31.62 35.38,31.25 v34.88,31.25 | LED18.A 89.75,31.25 v91.25,29.75 | LED19.A 77,31.25 v78,30.25 | v65.38,30 63.7,31.68 R16.1 62.42,31.68 62.25,31.5 57.77,31.5 LED20.A
  Bottom 0.61: v16.25,30 18.48,30 LED23.A1 19.41,30.64 LED23.A | v28.75,30 30.98,30 LED22.A1 31.91,30.64 LED22.A v34.88,31.25 | v54,30 55.98,30 LED20.A1 56.91,30.64 LED20.A | v65.38,30 68.48,30 LED19.A1 69.41,30.64 LED19.A | v78,30.25 79,30.25 79.75,29.5 80.48,29.5 LED18.A1 81.91,30.64 LED18.A | v91.25,29.75 93.23,29.75 LED17.A1 94.41,30.64 LED17.A | LED24.A1 6.91,30.64 LED24.A | LED21.A1 44.41,30.64 LED21.A
ROW7  (via drill 0.38)
  Top 0.254: 65.25,18.75 66.25,19.75 66.25,30.25 65.88,30.62 65.88,31.88 66.75,32.75 66.75,42.12 65.75,43.12 65.75,44.75 62.75,47.75 57.75,47.75 55.87,49.63 IC1.42
  Top 0.61: LED16.A 7.52,18.48 8.5,17.5 v16.5,17.5 | LED15.A 20.02,18.48 21,17.5 v29,17.5 | v53,17.5 51.75,18.75 LED13.A 45.02,17.77 44.5,17.25 33.25,17.25 32.5,18 32.5,18.73 LED14.A | LED10.A 90.25,18.75 v91.5,17.5 | LED11.A 78,18.75 v79,17.75 | v66,17.5 65.75,17.5 65.5,17.75 65.5,18.5 65.25,18.75 64,20 63.3,20 R17.1 62.8,20.5 59,20.5 58.5,20 58.5,19.25 58,18.75 LED12.A
  Bottom 0.61: v16.5,17.5 18.48,17.5 LED15.A1 19.41,18.14 LED15.A | v29,17.5 30.98,17.5 LED14.A1 31.91,18.14 LED14.A | v53,17.5 55.98,17.5 LED12.A1 56.91,18.14 LED12.A | v66,17.5 68.48,17.5 LED11.A1 69.41,18.14 LED11.A | LED16.A1 6.91,18.14 LED16.A | LED9.A 95.02,18.52 95,18.5 94.48,18.5 LED9.A1 93.48,17.5 v91.5,17.5 | LED10.A 82.23,18.75 LED10.A1 81.62,18.12 81,17.5 79.25,17.5 v79,17.75 | LED13.A1 44.41,18.14 LED13.A
ROW8  (via drill 0.38)
  Top 0.254: IC1.43 56.12,50.13 58,48.25 63,48.25 66.25,45 66.25,43.38 67.25,42.38 67.25,32.5 66.38,31.62 66.38,30.88 66.75,30.5 66.75,19.5 66.38,19.12 66.38,18.38 66.75,18 66.75,7.25 66.25,6.75 66.25,5 | 61.83,6.83 61.75,6.75
  Top 0.61: LED8.A 7.52,5.73 8.25,5 18.77,5 | 18.77,5 LED7.A | LED3.A 70.02,5.23 | 70.02,5.23 70.25,5 81.27,5 LED2.A 82.52,6.23 83.75,5 93.77,5 LED1.A | 18.77,5 31.27,5 LED6.A 37.5,6.25 v37.75,6 | LED4.A 56.27,5 46.27,5 LED5.A | 70.02,5.23 69.79,5 66.25,5 v61.75,5 61.75,6.75 61.75,8 62.75,9 R18.1
  Bottom 0.61: LED8.A1 6.91,5.64 LED8.A | LED6.A1 31.91,5.64 LED6.A | LED7.A1 19.41,5.64 LED7.A | LED5.A1 44.41,5.64 LED5.A 43.77,5 38.75,5 v37.75,6 | LED4.A1 57.23,6.25 LED4.A 57.52,5.73 58.25,5 v61.75,5 | LED3.A1 69.91,5.64 70.02,5.75 LED3.A | LED1.A1 94.41,5.64 LED1.A | LED2.A1 81.91,5.64 LED2.A
SHIFT_LEFT  (via drill 0.38)
  Top 0.2: 46.5,45.25 v46.5,45.38 | v48.25,47.62 48.5,47.5 48.62,47.38 50.25,47.38 50.88,46.75 52.75,46.75 52.8,46.7 IC1.36
  Top 0.254: JP2.4 15.01,51.26 17,53.25 27.75,53.25 28.75,52.25 28.75,45 28.38,44.62 28.38,42.75 28.88,42.25 34.88,42.25 35,42.38 40.5,42.38 41.62,41.25 45.38,41.25 46.75,42.62 46.75,45 46.5,45.25 46.5,45.12
  Bottom 0.2: v46.5,45.38 46.5,45.88 v48.25,47.62
SHIFT_RIGHT  (via drill 0.38)
  Top 0.254: IC1.35 52.3,44.45 52.5,44.25 53,44.25 54,45.25 60.38,45.25 61.12,44.5 63.75,44.5 64.25,44 64.25,42.25 64.12,42.12 v64.12,41.75 | JP3.4 95.75,53.5 93.5,53.5 92.75,52.75 92.75,47 87,41.25 69.75,41.25 69.5,41.5 69.25,41.5 v69,41.75
  Bottom 0.254: v69,41.75 66.5,41.75 65.75,41 64.88,41 v64.12,41.75
SWCLK  (via drill 0.38)
  Top 0.254: IC1.37 55.37,47.13 56.75,45.75 60.62,45.75 61.12,45.25 v62.5,45.25 | v64.75,47.75 65.75,49 SJ1.1 | v70,47.75 70,47.5 71.12,46.38 71.88,46.38 73.5,44.75 73.5,43.5 73.75,43.25 79,43.25 79.5,42.75 80.5,42.75 81.25,43.5 81.25,44 82.25,45 85.25,45 86,45.75 86,46 | JP7.4 85.29,50.21 86,49.5 86,46 | J1.4 90.33,51.17 90.62,50.88 90.62,46.88 90,46.25 88.38,46.25 v86.75,44.62 | v85.5,45.62 86,46
  Bottom 0.254: v62.5,45.25 62.5,45.75 v64.75,47.75 65,48 69.88,48 70,47.88 v70,47.75 | v86.75,44.62 v85.5,45.62
SWDAT  (via drill 0.38)
  Top 0.254: IC1.34 51.8,44.2 52.25,43.75 53.25,43.75 54.25,44.75 60.12,44.75 60.88,44 63.12,44 v63.38,43.75 | v66.75,45.62 66.75,50.24 SJ2.1 | v68.75,45.62 68.75,43.25 70.25,41.75 82.75,41.75 86.5,45.5 86.5,51 87,51.5 | J1.2 89.64,53.12 89.25,53.5 88,53.5 87.38,52.88 87.38,51.88 87.25,51.75 87,51.5 | 87,51.5 84.66,51.5 JP7.2
  Bottom 0.254: v68.75,45.62 v66.75,45.62 67,45.38 67,44.75 66,43.75 v63.38,43.75

## Text on the board
tPlace: SWD | SWD